# Altium schematic sheet DSN.SchDoc: Digital Serial Number
size A; Organization: UCLA High Energy Physics; Address1: L3, 12a Rodborough Rd; Address2: Frenchs Forest; Address3: NSW; Address4: Australia 2086; DocumentNumber: 20; Revision: 2.0; SheetNumber: 20; SheetTotal: 23; CurrentDate: 9/6/2018; ModifiedDate: 9/6/2018; ProjectName: Project
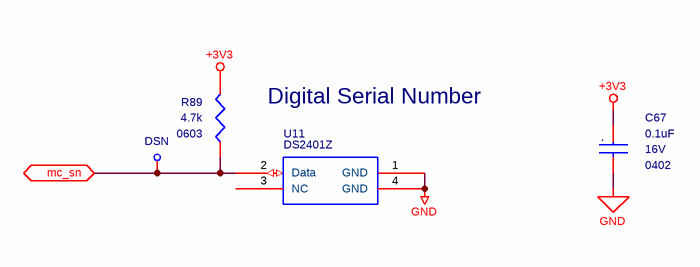
[diagram p0: DSN.SchDoc]

## Parts
C67  0.1uF  package: 0402  Voltage - Rated: 16V  [MC_S6/SM/C_0402_IPC]
DSN  Test Point Via  [MC_S6/TH/TPVIA]  (value not drawn)  (no BOM)
R89  4.7k  Supplier Device Package: 0603  [MC_S6/SM/R_0603_IPC]
U11  DS2401Z  [MC_S6/SM/SOT223_1243]

## Ports
mc_sn (bidir)

## Nets
+3V3: C67.1 R89.1
GND: C67.2 U11.1(GND) U11.4(GND)
mc_sn: DSN.1(In) R89.2 U11.2(Data) ; port mc_sn

Not connected (* = marked no-connect by the designer): U11 3(NC)

## Notes on the sheet
- Digital Serial Number
- Date:
- Rev:
- of
- Sheet
- (in symbol C0402C104K4RACTU) .

## Library data of the parts
C67 = C0402C104K4RACTU: CAP CER 0.1UF 16V X7R 0402; Manufacturer: KEMET; Capacitance: 0.10µF; Tolerance: ±10%; Supplier 1: Digi-Key; Manufacturer Part Number: C0402C104K4RACTU; RoHS: RoHS Compliant; Category: Capacitors; Stock 1: 3565698; Pricing 1: 1=0.11, 10=0.078, 25=0.0568, 50=0.0442, 100=0.0365, 250=0.03024, 500=0.02562, 1000=0.02121, 5000=0.01806 (USD); Packaging: Cut Tape (CT); Part Status: Active; Operating Temperature: -55°C ~ 125°C; Features: -; Ratings: -; Applications: General Purpose; Failure Rate: -; Mounting Type: Surface Mount, MLCC; Package / Case: 0402 (1005 Metric); Size / Dimension: 0.039" L x 0.020" W (1.00mm x 0.50mm); Height - Seated (Max): -; Thickness (Max): 0.022" (0.55mm); Lead Spacing: -; Lead Style: -; ComponentLink1URL: http://www.kemet.com/docfinder?Partnumber=C0402C104K4RACTU; ComponentLink1Description: http://www.kemet.com/docfinder?Partnumber=C0402C104K4RACTU; Supplier 2: Digi-Key; Stock 2: 3565998; Pricing 2: 1=0.11, 10=0.078, 25=0.0568, 50=0.0442, 100=0.0365, 250=0.03024, 500=0.02562, 1000=0.02121, 5000=0.01806 (USD); Supplier Part Number 1: 399-3521-1-ND; Supplier Part Number 2: 399-3521-6-ND; Temperature Coefficient: X7R
DSN = TPVIA: COMPSIDE: TOP; COMPGROUP: 0; mfgr: Layout; COMPROT: 0; Package: 90; mfgr_id: TPVIA; mfgr_foot: TPVIA
R89 = CR0603-FX-4701ELF: RES SMD 4.7K OHM 1% 1/10W 0603; Manufacturer: Bourns Inc.; Power (Watts): 0.1W, 1/10W; Temperature Coefficient: ±100ppm/°C; Supplier 1: Digi-Key; Manufacturer Part Number: CR0603-FX-4701ELF; RoHS: RoHS Compliant; Category: Resistors; Stock 1: 43560; Pricing 1: 1=0.1, 10=0.021, 100=0.0086, 1000=0.00385, 2500=0.00334 (USD); Packaging: Cut Tape (CT); Part Status: Active; Resistance (Ohms): 4.7k; Composition: Thick Film; Features: Moisture Resistant; Operating Temperature: -55°C ~ 155°C; Package / Case: 0603 (1608 Metric); Size / Dimension: 0.063" L x 0.031" W (1.60mm x 0.80mm); Height - Seated (Max): 0.022" (0.55mm); Failure Rate: -; ComponentLink1URL: http://www.bourns.com/docs/Product-Datasheets/CHPREZTR.pdf; ComponentLink1Description: http://www.bourns.com/docs/Product-Datasheets/CHPREZTR.pdf; Supplier 2: Digi-Key; Stock 2: 43560; Pricing 2: 1=0.1, 10=0.021, 100=0.0086, 1000=0.00385, 2500=0.00334 (USD); Supplier Part Number 1: CR0603-FX-4701ELFCT-ND; Supplier Part Number 2: CR0603-FX-4701ELFDKR-ND; Tolerance: ±1%
U11 = DS2401_sot223: IC Digital Serial Number; Manufacturer: Maxim Integrated; Manufacturer Part Number: DS2401Z+T&R; Supplier 1: Digi-Key; RoHS: RoHS Compliant; Category: Integrated Circuits (ICs); Stock 1: 8136; Pricing 1: 1=2, 10=1.89, 25=1.51, 50=1.43, 100=1.32, 250=1.25, 500=1.21 (USD); Packaging: Cut Tape (CT); Part Status: Active; Type: Silicon Serial Number; Applications: PCB, Network Node, Equipment Identification/Registration; Mounting Type: Surface Mount; Package / Case: TO-261-4, TO-261AA; Supplier Device Package: SOT-223-3; ComponentLink1URL: http://pdfserv.maximintegrated.com/en/ds/DS2401.pdf; ComponentLink1Description: http://pdfserv.maximintegrated.com/en/ds/DS2401.pdf; Supplier 2: Digi-Key; Stock 2: 8136; Pricing 2: 1=2, 10=1.89, 25=1.51, 50=1.43, 100=1.32, 250=1.25, 500=1.21 (USD); Supplier Part Number 1: DS2401Z+T&RCT-ND; Supplier Part Number 2: DS2401Z+T&RDKR-ND